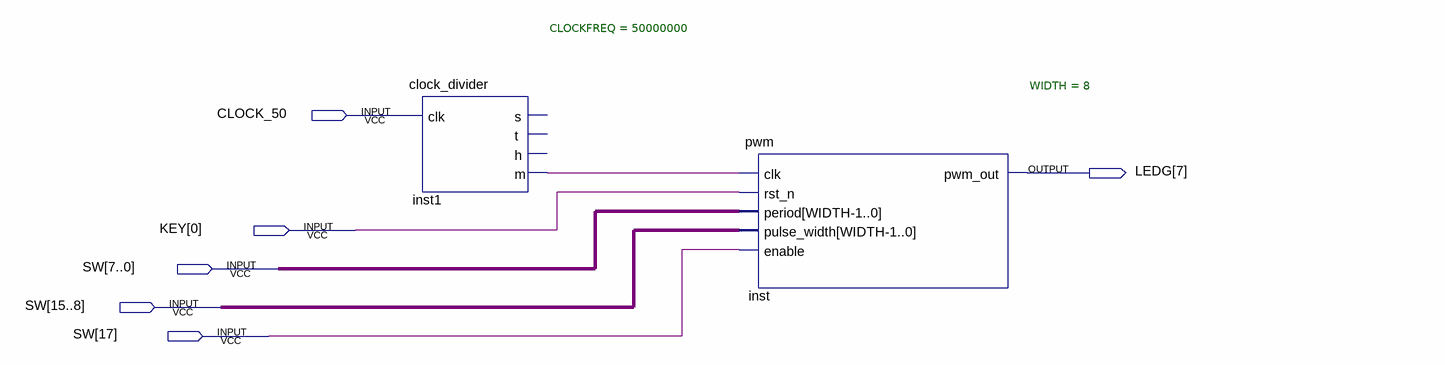
[diagram p0: schematic sheet]
// Quartus schematic PWM_Gold_Team.bdf as structural Verilog: 2 symbols, 6 pins
module PWM_Gold_Team (
  input  CLOCK_50,
  input  [0:0] KEY,
  input  [17:0] SW,
  output [7:7] LEDG
);

  wire inst1_m;

  clock_divider #(.CLOCKFREQ(50000000)) inst1 (.m(inst1_m));  // open: clk, s, t, h
  pwm #(.WIDTH(8)) inst (
    .clk(inst1_m), .rst_n(KEY[0]), .period(SW[7:0]), .pulse_width(SW[15:8]), .enable(SW[17]),
    .pwm_out(LEDG[7]));
endmodule
